# EAGLE design observer (EAGLE 9.4.2)
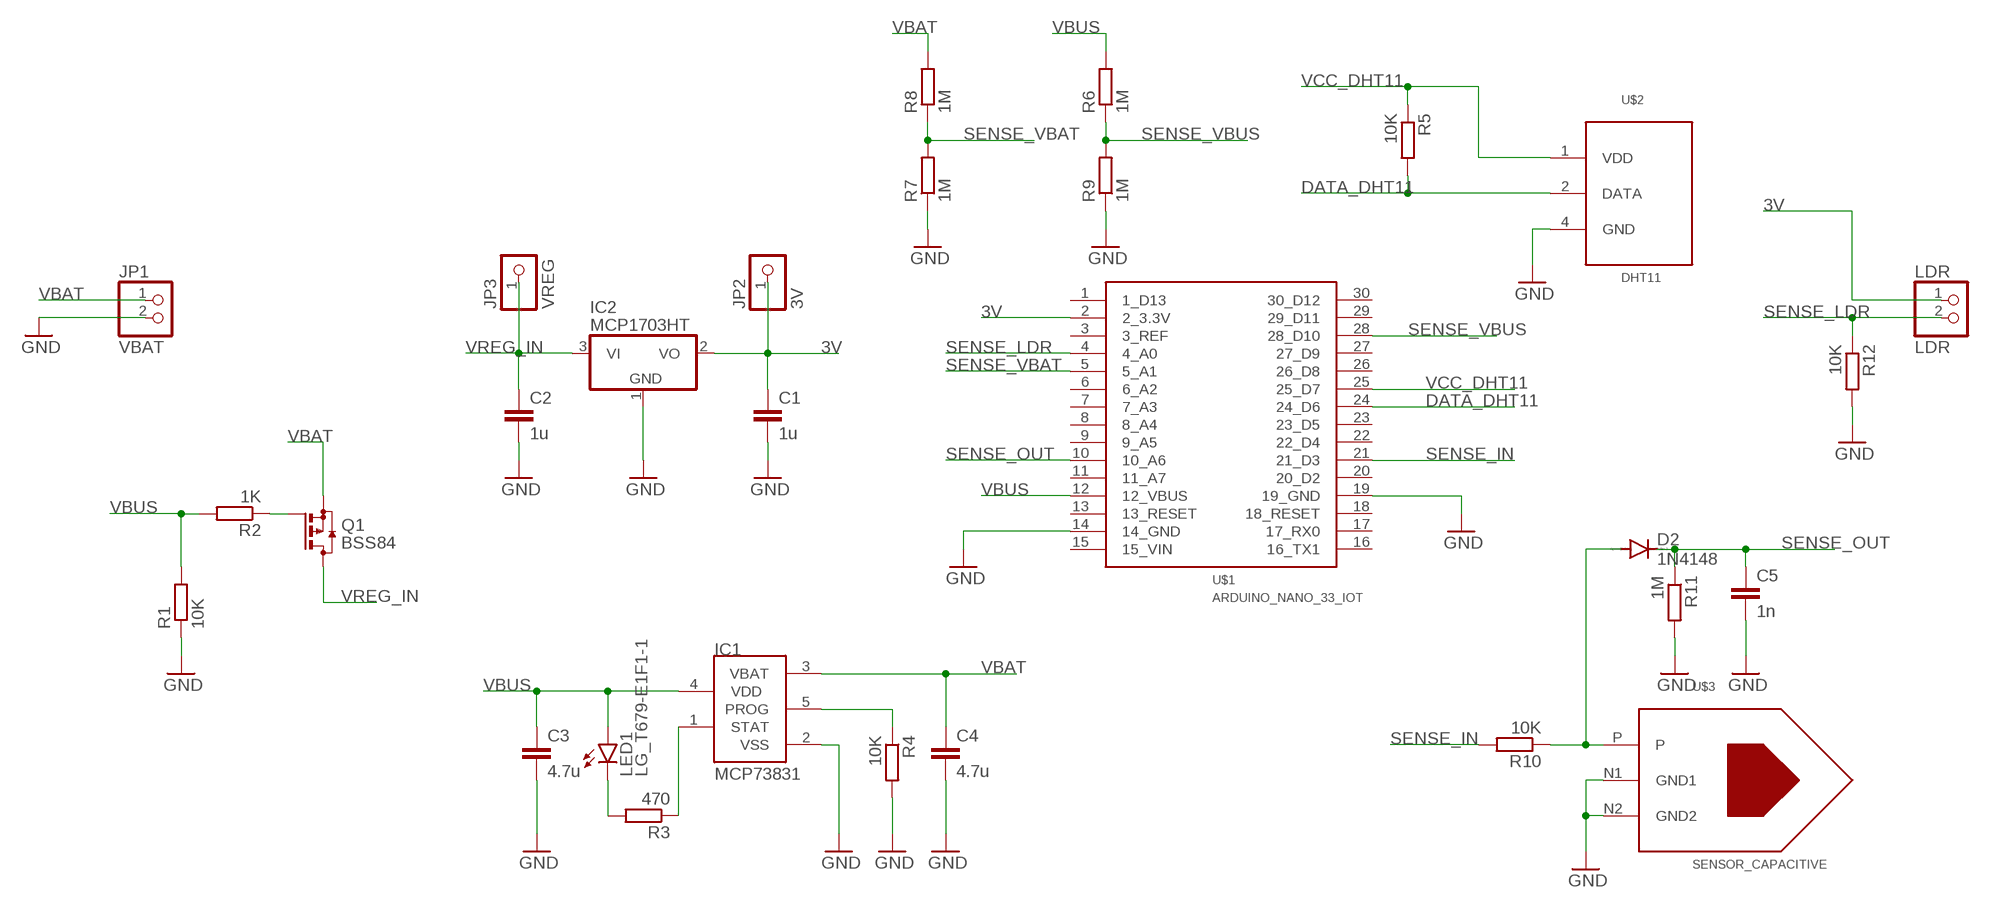
[diagram p0: schematic, sheet 1]

## Parts
C1  1u  C-EUC0805  [C0805]
C2  1u  C-EUC0805  [C0805]
C3  4.7u  C-EUC0805  [C0805]
C4  4.7u  C-EUC0805  [C0805]
C5  1n  C-EUC0805  [C0805]
D2  1N4148  DIODE-MICROMELF-W  [MICROMELF-W]
IC1  MCP73831  [SOT23-5L]
IC2  MCP1703HT  MCP1703CB  [SOT23]
JP1  VBAT  PINHD-1X2  [1X02]
JP2  3V  PINHD-1X1  [1X01]
JP3  VREG  PINHD-1X1  [1X01]
LDR  LDR  PINHD-1X2  [1X02]
LED1  LG_T679-E1F1-1  [PLCC2]
Q1  BSS84  [SOT23]
R1  10K  R-EU_R0805  [R0805]
R2  1K  R-EU_R0805  [R0805]
R3  470  R-EU_R0805  [R0805]
R4  10K  R-EU_R0805  [R0805]
R5  10K  R-EU_R0805  [R0805]
R6  1M  R-EU_R0805  [R0805]
R7  1M  R-EU_R0805  [R0805]
R8  1M  R-EU_R0805  [R0805]
R9  1M  R-EU_R0805  [R0805]
R10  10K  R-EU_R0805  [R0805]
R11  1M  R-EU_R0805  [R0805]
R12  10K  R-EU_R0805  [R0805]
U$1  ARDUINO_NANO_33_IOT  [ARDUINO_NANO_33_IOT]
U$2  DHT11  [DHT11]
U$3  SENSOR_CAPACITIVE  [SENSOR_CAPACITIVE_MOISTURE]

## Nets
3V: C1.1 IC2.2(VO) JP2.1 LDR.1 U$1.2(2_3.3V)
DATA_DHT11: R5.2 U$1.24(24_D6) U$2.2(DATA)
GND: C1.2 C2.2 C3.2 C4.2 C5.2 IC1.2(VSS) IC2.1(GND) JP1.2 R1.1 R4.2 R7.1 R9.1 R11.2 R12.2 U$1.14(14_GND) U$1.19(19_GND) U$2.4(GND) U$3.N1(GND1) U$3.N2(GND2)
N$1: Q1.1(G) R2.1
N$2: LED1.C R3.2
N$3: IC1.1(STAT) R3.1
N$4: IC1.5(PROG) R4.1
N$6: D2.A R10.1 U$3.P
SENSE_IN: R10.2 U$1.21(21_D3)
SENSE_LDR: LDR.2 R12.1 U$1.4(4_A0)
SENSE_OUT: C5.1 D2.C R11.1 U$1.10(10_A6)
SENSE_VBAT: R7.2 R8.1 U$1.5(5_A1)
SENSE_VBUS: R6.1 R9.2 U$1.28(28_D10)
VBAT: C4.1 IC1.3(VBAT) JP1.1 Q1.2(S) R8.2
VBUS: C3.1 IC1.4(VDD) LED1.A R1.2 R2.2 R6.2 U$1.12(12_VBUS)
VCC_DHT11: R5.1 U$1.25(25_D7) U$2.1(VDD)
VREG_IN: C2.1 IC2.3(VI) JP3.1 Q1.3(D)
Unconnected: U$1.1(1_D13) U$1.3(3_REF) U$1.6(6_A2) U$1.7(7_A3) U$1.8(8_A4) U$1.9(9_A5) U$1.11(11_A7) U$1.13(13_RESET) U$1.15(15_VIN) U$1.16(16_TX1) U$1.17(17_RX0) U$1.18(18_RESET) U$1.20(20_D2) U$1.22(22_D4) U$1.23(23_D5) U$1.26(26_D8) U$1.27(27_D9) U$1.29(29_D11) U$1.30(30_D12)

## Library data of the parts
C1-C5 = rcl:C-EU: CAPACITOR, European symbol; SPICEPREFIX: C
D2 = diode:DIODE-: DIODE
IC1 = microchip-update:MCP73831: Miniature Single-Cell, Fully Integrated Li-Ion, Li-Polymer Charge Management Controllers
IC2 = linear:MCP1703: 250 mA, 16V, Low Quiescent Current LDO Regulator Source: http://ww1.microchip.com/downloads/en/DeviceDoc/22049b.pdf
JP1 LDR = pinhead:PINHD-1X2: PIN HEADER
JP2 JP3 = pinhead:PINHD-1X1: PIN HEADER
LED1 = led:*_T679-?-1: LC TOPLED® Low Current LED Source: http://catalog.osram-os.com .. LG_LS_LY_T679_OBS.pdf; COLOR: green
Q1 = transistor-small-signal:BSS84: P-CHANNEL MOS FET
R1-R12 = rcl:R-EU_: RESISTOR, European symbol; SPICEPREFIX: R
U$1 = my-library:ARDUINO_NANO_33_IOT
U$2 = my-library:DHT11
U$3 = my-library:SENSOR_CAPACITIVE

## Board
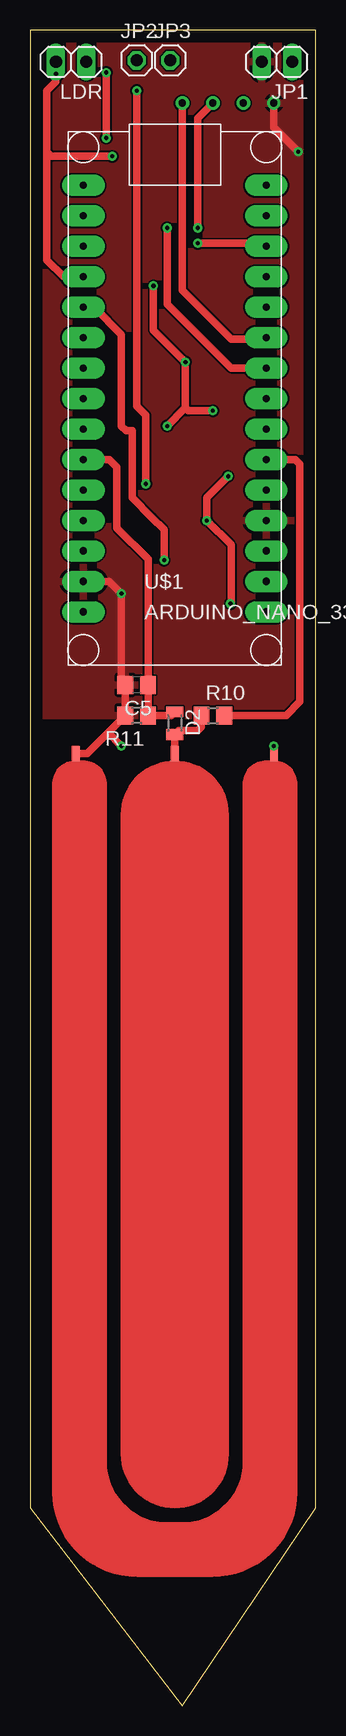
[diagram p1: board, top side]
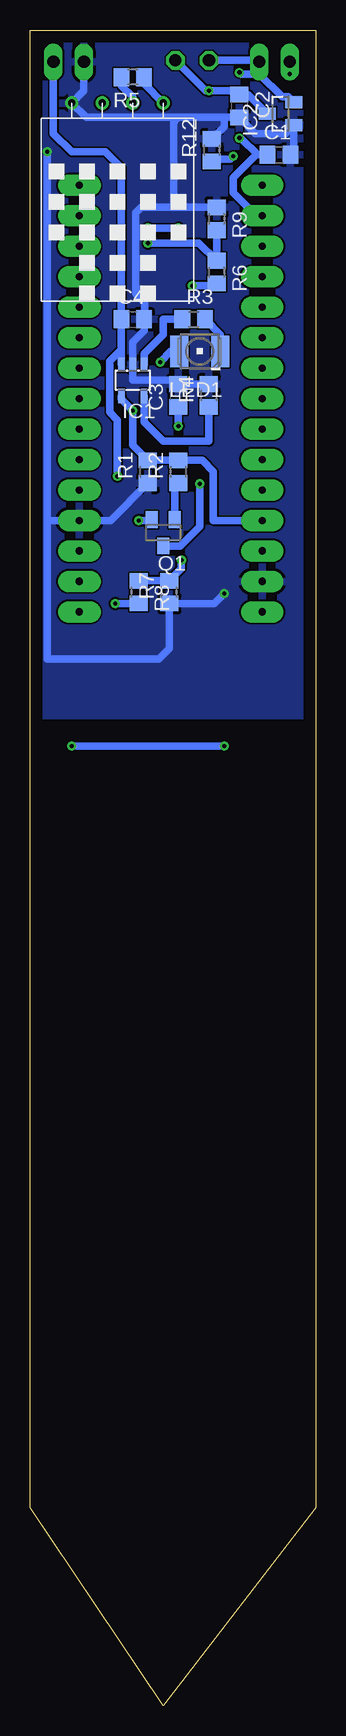
[diagram p2: board, bottom side, seen from below]

Size 23.8 x 139.69 mm. Coordinates in mm from the lower left corner, seen from the top.
Outline: 0,139.69 0,16.51 12.7,0 23.8,16.51 23.8,139.69 0,139.69
Copper layers (1*16): Top 0.035mm / dielectric 1.5mm / Bottom 0.035mm
Design rules "default": minimum track width 6mil, minimum drill 0.35mm, track to track 6mil, track to pad 6mil, pad to pad 6mil, via to via 6mil, smd to smd 6mil, copper to edge 40mil, drill to drill 6mil, minimum pad ring 10mil, minimum via ring 8mil, stop-mask expansion 4mil, vias tented up to drill 0mil, thermal gap 10mil

### Footprints (pad centres in the part's own frame; a part is rotated, then mirrored left to right if it is on the bottom)
C0805 = smd 1.3 x 1.5: 1 -0.95,0; 2 0.95,0
MICROMELF-W = smd 0.9 x 1.4: A 0.95,0; C -0.95,0
SOT23-5L = smd 0.55 x 1.2: 1 -0.95,-1.3; 2 0,-1.3; 3 0.95,-1.3; 4 0.95,1.3; 5 -0.95,1.3
SOT23 = smd 1 x 1.4: 1 -0.95,-1.1; 2 0.95,-1.1; 3 0,1.1
1X02 = drill 1.016 long: 1 -1.27,0; 2 1.27,0
1X01 = drill 1.016 octagon: 1 0,0
PLCC2 = smd 2.6 x 1.5: A 0,1.7; C 0,-1.7
R0805 = smd 1.3 x 1.5: 1 -0.95,0; 2 0.95,0
ARDUINO_NANO_33_IOT = drill 0.6 pad 1.778 long: 1 1.27,-4.445; 2 1.27,-6.985; 3 1.27,-9.525; 4 1.27,-12.065; 5 1.27,-14.605; 6 1.27,-17.145; 7 1.27,-19.685; 8 1.27,-22.225; 9 1.27,-24.765; 10 1.27,-27.305; 11 1.27,-29.845; 12 1.27,-32.385; 13 1.27,-34.925; 14 1.27,-37.465; 15 1.27,-40.005; 16 16.51,-40.005; 17 16.51,-37.465; 18 16.51,-34.925; 19 16.51,-32.385; 20 16.51,-29.845; 21 16.51,-27.305; 22 16.51,-24.765; 23 16.51,-22.225; 24 16.51,-19.685; 25 16.51,-17.145; 26 16.51,-14.605; 27 16.51,-12.065; 28 16.51,-9.525; 29 16.51,-6.985; 30 16.51,-4.445
DHT11 = drill 0.6: 1 10.16,1.27; 2 7.62,1.27; 3 5.08,1.27; 4 2.54,1.27
SENSOR_CAPACITIVE_MOISTURE = smd 0.635 x 1.27: N1 -3.81,0.635; N2 12.7,0.635; P 4.445,0.635

### Placement (x,y rotation side)
C1  3.05,129.29 0 bottom
C2  6.35,133.35 270 bottom
C3  11.43,109.22 90 bottom
C4  15.24,115.57 0 bottom
C5  8.89,85.09 180 top
D2  12.06,81.91 270 top
IC1  15.24,110.49 180 bottom
IC2  2.92,132.72 90 bottom
JP1  20.57,137.03 180 top
JP2  8.89,137.16 0 top
JP3  11.68,137.16 0 top
LDR  3.43,137.03 180 top
LED1  9.65,112.9 90 bottom
Q1  12.7,97.79 180 bottom
R1  13.97,102.87 90 bottom
R2  11.43,102.87 90 bottom
R3  10.16,115.57 0 bottom
R4  8.89,109.22 90 bottom
R5  15.24,135.76 180 bottom
R6  8.26,119.51 270 bottom
R7  12.19,92.84 90 bottom
R8  14.73,92.84 270 bottom
R9  8.26,123.95 270 bottom
R10  15.24,82.55 0 top
R11  8.89,82.55 180 top
R12  8.64,129.67 90 bottom
U$1  3.17,131.19 0 top
U$2  22.86,132.33 0 bottom
U$3  7.62,78.74 0 top

### Tracks (layer width: path | path; a pad name or v marks a point on that pad's centre or on a via)
3V  (via drill 0.35)
  Top 0.61: v6.35,136.14 v6.35,130.68
  Bottom 0.61: IC2.2 2.27,134.11 2.79,134.11 4.7,136.02 | 4.7,136.02 LDR.1 4.83,137.16 JP2.1 | v6.35,130.68 6.22,130.68 4.83,129.29 C1.1 4.95,129.29 6.86,127.38 6.86,126.11 4.95,124.21 U$1.2 | v6.35,136.14 6.22,136.02 4.7,136.02
DATA_DHT11  (via drill 0.35)
  Top 0.61: U$2.2 13.97,132.33 v13.97,123.19 | v11.43,123.19 11.43,116.84 16.76,111.51 U$1.24
  Bottom 0.61: U$2.2 15.24,134.11 16.19,135.06 R5.2 | v13.97,123.19 v11.43,123.19
GND  (via drill 0.35)
  Top 0.61: 6.51,81.12 R11.2 C5.2 7.62,85.41 v7.62,92.71 6.6,93.73 U$1.14 | 6.51,81.12 4.77,79.38 U$3.N1 | U$3.N2 v20.32,80.01 | v7.62,80.01 6.51,81.12 | v22.35,129.54 20.32,131.57 U$2.4
  Bottom 0.61: R4.2 C3.2 11.75,110.49 15.24,110.49 IC1.2 15.24,113.67 14.29,114.61 C4.2 14.22,115.64 14.22,116.97 14.99,117.73 14.99,124.46 14.54,124.9 11.74,124.9 | R1.1 17.08,98.81 U$1.19 22.35,98.81 | C1.2 1.82,129.56 IC2.1 2.52,131.06 5.01,131.06 C2.2 7.62,132.4 | JP1.2 19.3,134.62 U$2.4 19.12,132.4 11.43,132.4 | v20.32,80.01 v7.62,80.01 | 11.43,132.4 7.62,132.4 | v7.62,92.71 8.44,91.89 R7.1 12.19,88.14 13.08,87.25 22.35,87.25 22.35,98.81 | R12.2 7.62,131.63 7.62,132.4 | R9.1 11.74,124.9 | 11.74,124.9 11.81,124.97 11.81,132.02 11.43,132.4 | 22.35,98.81 v22.35,129.54
  pour Bottom: 0,139.7 0,82.55 24.13,82.55 24.13,139.7
  pour Top: 0,139.7 0,82.55 24.13,82.55 24.13,139.7
N$1
  Bottom 0.61: R2.1 11.75,101.6 Q1.1
N$2
  Bottom 0.61: R3.2 7.95,114.31 LED1.C
N$3
  Bottom 0.61: R3.1 12.7,115.57 12.7,114.3 14.29,112.71 IC1.1
N$4
  Bottom 0.61: R4.1 8.89,105.41 12.7,105.41 14.29,107 IC1.5
N$6
  Top 0.61: U$3.P D2.A 12.38,81.28 13.97,81.28 14.29,81.6 R10.1
SENSE_IN
  Top 0.61: U$1.21 22.1,103.89 22.48,103.5 22.48,83.69 21.34,82.55 R10.2
SENSE_LDR  (via drill 0.35)
  Top 0.61: v2.16,136.02 2.16,135.38 1.4,134.62 1.4,129.54 | 1.4,129.54 1.4,120.52 2.79,119.13 U$1.4 | v6.86,129.16 1.78,129.16 1.4,129.54
  Bottom 0.61: LDR.2 v2.16,136.02 | R12.1 8.45,128.91 7.11,128.91 v6.86,129.16
SENSE_OUT
  Top 0.61: D2.C 11.75,82.55 R11.1 C5.1 9.84,95.57 7.24,98.17 7.24,103.25 6.6,103.89 U$1.10
SENSE_VBAT  (via drill 0.35)
  Top 0.61: U$1.5 5.33,116.59 7.62,114.3 7.62,106.68 8,106.3 8.51,106.3 8.51,100.71 10.16,99.06 11.18,98.04 v11.18,95.5
  Bottom 0.61: R8.1 R7.2 11.18,94.8 v11.18,95.5
SENSE_VBUS  (via drill 0.35)
  Top 0.61: U$1.28 19.43,121.92 v13.97,121.92
  Bottom 0.61: R9.2 R6.1 9.72,121.92 v13.97,121.92
VBAT  (via drill 0.35)
  Top 0.61: v16.51,102.49 14.73,100.71 v14.73,98.81 16.76,96.77 16.76,91.95 v16.7,91.89
  Bottom 0.61: JP1.1 21.84,131.06 20.32,129.54 17.53,129.54 16.19,128.2 C4.1 16.19,113.03 | 16.19,113.03 IC1.3 | 16.19,113.03 17.14,112.08 17.14,107.82 16.51,107.19 v16.51,102.49 | v14.73,98.81 13.73,98.81 Q1.2 | v16.7,91.89 R8.2
VBUS  (via drill 0.35)
  Top 0.61: 12.95,108.2 v12.95,112.01 10.29,114.68 v10.29,118.36 | 12.95,108.2 v11.43,106.68 | v15.24,107.95 13.21,107.95 12.95,108.2
  Bottom 0.61: LED1.A 12.06,112.9 v12.95,112.01 | v11.43,106.68 C3.1 | IC1.4 16.19,108.9 v15.24,107.95 15.24,105.09 R1.2 R2.2 9.46,103.82 8.51,102.87 8.51,98.81 U$1.12 | R6.2 8.45,118.36 v10.29,118.36
VCC_DHT11
  Top 0.61: U$1.25 19.56,113.92 16.76,113.92 12.7,117.98 U$2.1
  Bottom 0.61: R5.1 14.29,135.19 U$2.1
VREG_IN  (via drill 0.35)
  Top 0.61: v9.65,101.85 9.65,107.57 8.89,108.33 v8.89,134.62
  Bottom 0.61: JP3.1 9.14,134.62 v8.89,134.62 6.67,134.62 C2.1 5.61,134.3 IC2.3 | Q1.3 11.26,96.69 9.65,98.3 v9.65,101.85